# EAGLE schematic gps-tracker (EAGLE 6.4)
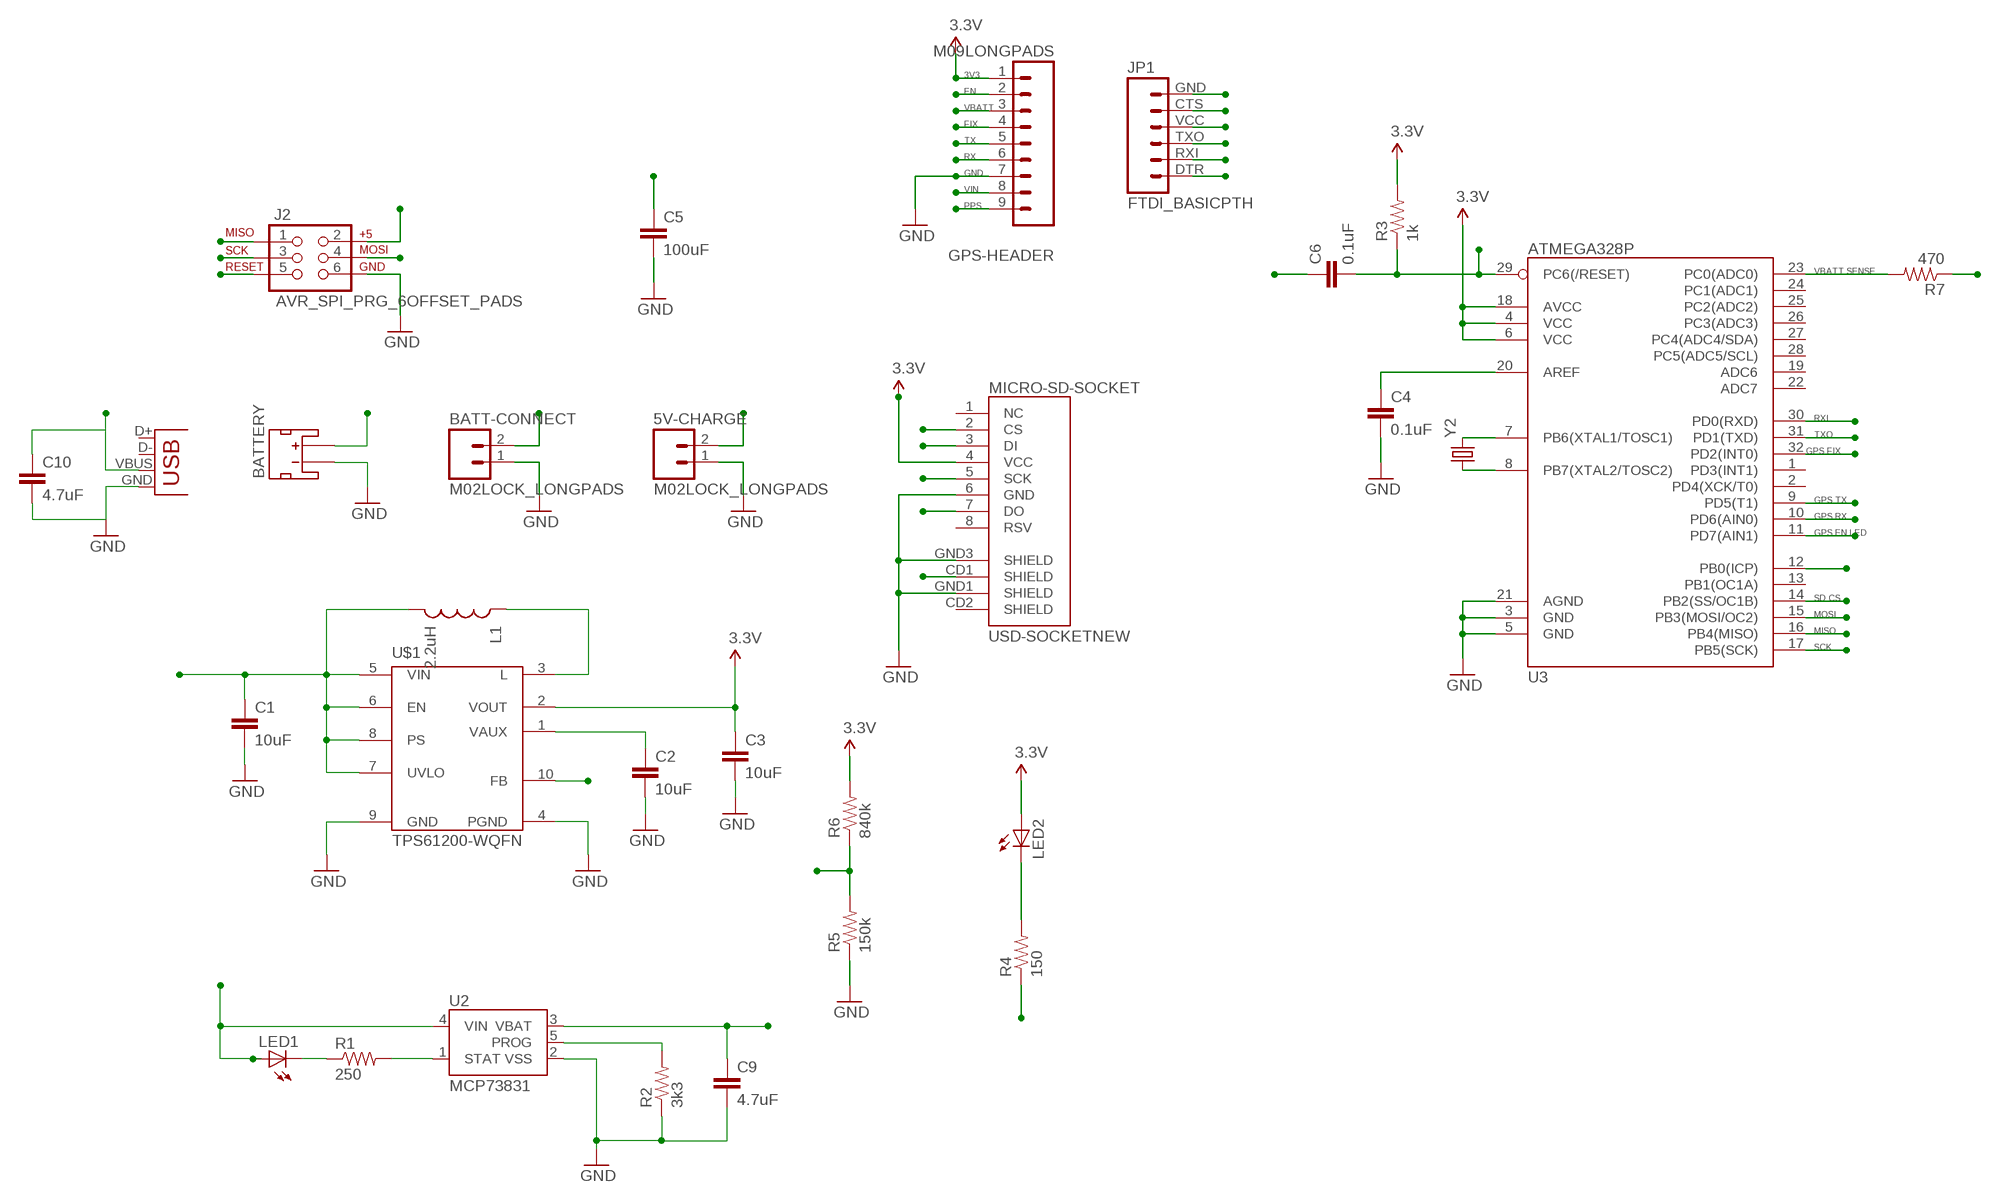
[diagram p0: schematic, sheet 1]

## Parts
5V-CHARGE  M02LOCK_LONGPADS  [1X02_LOCK_LONGPADS]
BATT-CONNECT  M02LOCK_LONGPADS  [1X02_LOCK_LONGPADS]
BATTERY  JST_2MM_MALE  [JST-2-SMD]
C1  10uF  CAP1206  [1206]
C2  10uF  CAP1206  [1206]
C3  10uF  CAP1206  [1206]
C4  0.1uF  CAP0603-CAP  [0603-CAP]
C5  100uF  CAP1206  [1206]
C6  0.1uF  CAP0603-CAP  [0603-CAP]
C9  4.7uF  CAP1206  [1206]
C10  4.7uF  CAP1206  [1206]
GPS-HEADER  M09LONGPADS  [1X09_LONGPADS]
J2  AVR_SPI_PRG_6OFFSET_PADS  [2X3_OFFSET]
JP1  FTDI_BASICPTH  [FTDI_BASIC]
L1  2.2uH  INDUCTOR-  [CDRH3D28]
LED1  LED0603  [LED-0603]
LED2  LED5MM  [LED5MM]
MICRO-SD-SOCKET  USD-SOCKETNEW  [MICRO-SD-SOCKET-PP]
R1  250  RESISTOR0603-RES  [0603-RES]
R2  3k3  RESISTOR0603-RES  [0603-RES]
R3  1k  RESISTOR0805-RES  [0805]
R4  150  RESISTOR0805-RES  [0805]
R5  150k  RESISTOR0603-RES  [0603-RES]
R6  840k  RESISTOR0603-RES  [0603-RES]
R7  470  RESISTOR0805-RES  [0805]
U2  MCP73831  [SOT23-5]
U3  ATMEGA328P  ATMEGA328_SMT  [TQFP32-08]
U$1  TPS61200-WQFN  [QFN-10]
X1  USBSMD  [USB-MINIB]
Y2  CRYSTAL5X3  [CRYSTAL-SMD-5X3]

## Nets
3.3V: C3.1 GPS-HEADER.1 LED2.A MICRO-SD-SOCKET.4(VCC) R3.2 R6.2 U3.4(VCC) U3.6(VCC) U3.18(AVCC) U$1.2(VOUT)
/RESET: C6.2 J2.5 R3.1 U3.29(PC6(/RESET))
BATT_LED: R4.1 U3.12(PB0(ICP))
CD: MICRO-SD-SOCKET.CD1(SHIELD)
DTR: C6.1 JP1.DTR
EN: GPS-HEADER.2
FB: R5.2 R6.1 U$1.10(FB)
GND: 5V-CHARGE.1 BATT-CONNECT.1 BATTERY.1(-) C1.2 C2.2 C3.2 C4.2 C5.2 C9.2 C10.2 GPS-HEADER.7 J2.6 JP1.CTS JP1.GND MICRO-SD-SOCKET.6(GND) MICRO-SD-SOCKET.GND1(SHIELD) MICRO-SD-SOCKET.GND3(SHIELD) R2.1 R5.1 U2.2(VSS) U3.3(GND) U3.5(GND) U3.21(AGND) U$1.4(PGND) U$1.9(GND) X1.GND
GPS_EN_LED: U3.11(PD7(AIN1))
GPS_FIX: GPS-HEADER.4 U3.32(PD2(INT0))
GPS_RX: GPS-HEADER.6 U3.9(PD5(T1))
GPS_TX: GPS-HEADER.5 U3.10(PD6(AIN0))
MISO: J2.1 MICRO-SD-SOCKET.7(DO) U3.16(PB4(MISO))
MOSI: J2.4 MICRO-SD-SOCKET.3(DI) U3.15(PB3(MOSI/OC2))
N$1: R1.2 U2.1(STAT)
N$2: L1.1 U$1.3(L)
N$3: LED1.C R1.1
N$4: C2.1 U$1.1(VAUX)
N$5: LED2.K(C) R4.2
N$6: R2.2 U2.5(PROG)
N$9: J2.2
N$11: R7.2 U3.23(PC0(ADC0))
N$15: GPS-HEADER.3
N$16: C4.1 U3.20(AREF)
N$24: U3.7(PB6(XTAL1/TOSC1)) Y2.3
N$25: U3.8(PB7(XTAL2/TOSC2)) Y2.1
PPS: GPS-HEADER.9
RXI: JP1.TXO U3.31(PD1(TXD))
SCK: J2.3 MICRO-SD-SOCKET.5(SCK) U3.17(PB5(SCK))
SD_CS: MICRO-SD-SOCKET.2(CS) U3.14(PB2(SS/OC1B))
TXO: JP1.RXI U3.30(PD0(RXD))
VBATT: BATT-CONNECT.2 BATTERY.2(+) C1.1 C5.1 C9.1 L1.2 R7.1 U2.3(VBAT) U$1.5(VIN) U$1.6(EN) U$1.7(UVLO) U$1.8(PS)
VCC_DNU: JP1.VCC
VIN: GPS-HEADER.8
VUSB: 5V-CHARGE.2 C10.1 LED1.A U2.4(VIN) X1.VBUS
Unconnected: BATTERY.NC1(PAD1) BATTERY.NC2(PAD2) MICRO-SD-SOCKET.1(NC) MICRO-SD-SOCKET.8(RSV) MICRO-SD-SOCKET.CD2(SHIELD) U3.1(PD3(INT1)) U3.2(PD4(XCK/T0)) U3.13(PB1(OC1A)) U3.19(ADC6) U3.22(ADC7) U3.24(PC1(ADC1)) U3.25(PC2(ADC2)) U3.26(PC3(ADC3)) U3.27(PC4(ADC4/SDA)) U3.28(PC5(ADC5/SCL)) X1.D+ X1.D-

## Notes on the sheet
- 3V3
- EN
- VBATT
- FIX
- TX
- RX
- GND
- VIN
- PPS
- VBATT SENSE
- RXI
- TXO
- GPS FIX
- GPS TX
- GPS RX
- GPS EN LED
- SD CS
- MOSI
- MISO
- SCK

## Library data of the parts
5V-CHARGE BATT-CONNECT = SparkFun-Connectors:M02: Standard 2-pin 0.1" header. Use with - straight break away headers ( PRT-00116) - right angle break away headers (PRT-00553) - swiss pins (PRT-00743) - machine pins (PRT-00117) - female headers (PRT-00115) Molex polarized connector foot print use with: PRT-08233 with associated crimp pins and housings. 2.54_SCREWTERM for use with PRT-10571. 3.5mm Screw Terminal footprints for PRT-08084 5mm Screw Terminal footprints for use with PRT-08433
BATTERY = SparkFun-Connectors:JST_2MM_MALE: Mates to single-cell LiPo batteries. CONN-08352; PROD_ID: CONN-08352
C1-C3 C9 C10 = SparkFun:CAP: Capacitor Standard 0603 ceramic capacitor, and 0.1" leaded capacitor.
C4-C6 = SparkFun-Capacitors:CAP: Capacitor Standard 0603 ceramic capacitor, and 0.1" leaded capacitor.
GPS-HEADER = SparkFun-Connectors:M09: Header 9 Standard 9-pin 0.1" header. Use with straight break away headers (SKU : PRT-00116), right angle break away headers (PRT-00553), swiss pins (PRT-00743), machine pins (PRT-00117), and female headers (PRT-00115).
J2 = SparkFun-Connectors:AVR_SPI_PRG_6: AVR ISP 6 Pin This is the reduced ISP connector for AVR programming. Common on Arduino. This footprint will take up less PCB space and can be used with a 10-pin to 6-pin adapter such as SKU: BOB-08508
JP1 = SparkFun-Connectors:FTDI_BASIC: FTDI Basic header with labels
L1 = SparkFun:INDUCTOR: Inductors Basic Inductor/Choke - 0603 and 1206. Footprints are not proven and vary greatly between part numbers.
LED1 = SparkFun:LED: LEDs Standard schematic elements and footprints for 5mm, 3mm, 1206, and 0603 sized LEDs. 5mm - Spark Fun Electronics SKU : COM-00529 (and others)
LED2 = SparkFun-LED:LED: LEDs Standard schematic elements and footprints for 5mm, 3mm, 1206, and 0603 sized LEDs. 5mm - Spark Fun Electronics SKU : COM-00529 (and others)
MICRO-SD-SOCKET = SparkFun-Connectors:USD-SOCKET: microSD Socket Push-push type uSD socket. Schematic element and footprint production proven. Spark Fun Electronics SKU : PRT-00127. tDoc lines correctly indicate media card edge positions when inserting (unlocked, locked, depressed).
R1-R7 = SparkFun:RESISTOR: Resistor Basic schematic elements and footprints for 0603, 1206, and PTH resistors.
U2 = SparkFun:MCP73831: Microchip's MCP73831 Miniature single cell, fully integrated Li-Ion, Li-polymer charge management controller http://ww1.microchip.com/downloads/en/DeviceDoc/21984a.pdf
U3 = SparkFun-DigitalIC:ATMEGA328_SMT: 32-Pin Atmega328 part Commonly used on Arduino compatible boards Available in QFP and QFN packages TQFP is IC-09069 QFN is non-stock; PROD_ID: IC-09069
U$1 = Synapseware:TPS61200
X1 = SparkFun:USB: USB Connectors USB-B-PTH is fully proven SKU : PRT-00139 USB-miniB is fully proven SKU : PRT-00587 USB-A-PCB is untested. USB-A-H is throughly reviewed, but untested. Spark Fun Electronics SKU : PRT-00437 USB-B-SMT is throughly reviewed, but untested. Needs silkscreen touching up. USB-A-S has not been used/tested USB-MB-H has not been used/tested
Y2 = SparkFun-FreqCtrl:CRYSTAL: Various standard crystals. Proven footprints. Spark Fun Electronics SKU : COM-00534